# Altium project MABSS_voltageSensor.PrjPcb
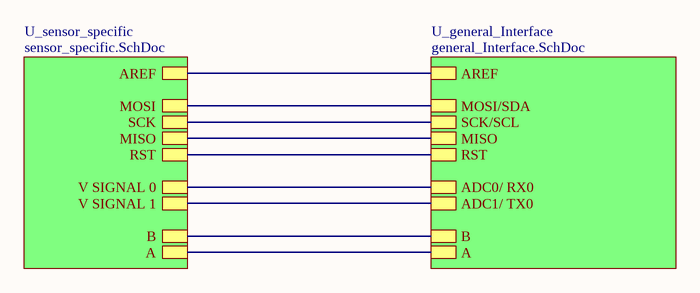
[diagram p0: master_sheet.SchDoc]
3 sheets, 22 parts. Net scope: hierarchical (ports join the sheet entries above them; power ports are global).
Board file: MABSS_voltageSensor.PcbDoc
Sheets:
  master_sheet.SchDoc
    U_sensor_specific = sensor_specific.SchDoc
    U_general_Interface = general_Interface.SchDoc

## Sheet master_sheet.SchDoc
size A4

### Sub-sheets
U_general_Interface = general_Interface.SchDoc: AREF, MOSI/SDA, SCK/SCL, MISO, RST, ADC0/ RX0, ADC1/ TX0, B, A
U_sensor_specific = sensor_specific.SchDoc: MOSI, SCK, MISO, RST, B, A, AREF, V SIGNAL 0, V SIGNAL 1

### Nets
NetHDR1_1: sheet U_sensor_specific/MISO, sheet U_general_Interface/MISO
NetHDR1_3: sheet U_sensor_specific/SCK, sheet U_general_Interface/SCK/SCL
NetHDR1_4: sheet U_sensor_specific/MOSI, sheet U_general_Interface/MOSI/SDA
NetHDR1_5: sheet U_sensor_specific/RST, sheet U_general_Interface/RST
NetHDR2_2: sheet U_sensor_specific/A, sheet U_general_Interface/A
NetHDR2_3: sheet U_sensor_specific/B, sheet U_general_Interface/B
NetR1_1: sheet U_sensor_specific/AREF, sheet U_general_Interface/AREF
NetR2_2: sheet U_sensor_specific/V SIGNAL 1, sheet U_general_Interface/ADC1/ TX0
NetR4_2: sheet U_sensor_specific/V SIGNAL 0, sheet U_general_Interface/ADC0/ RX0

## Sheet sensor_specific.SchDoc
size A4
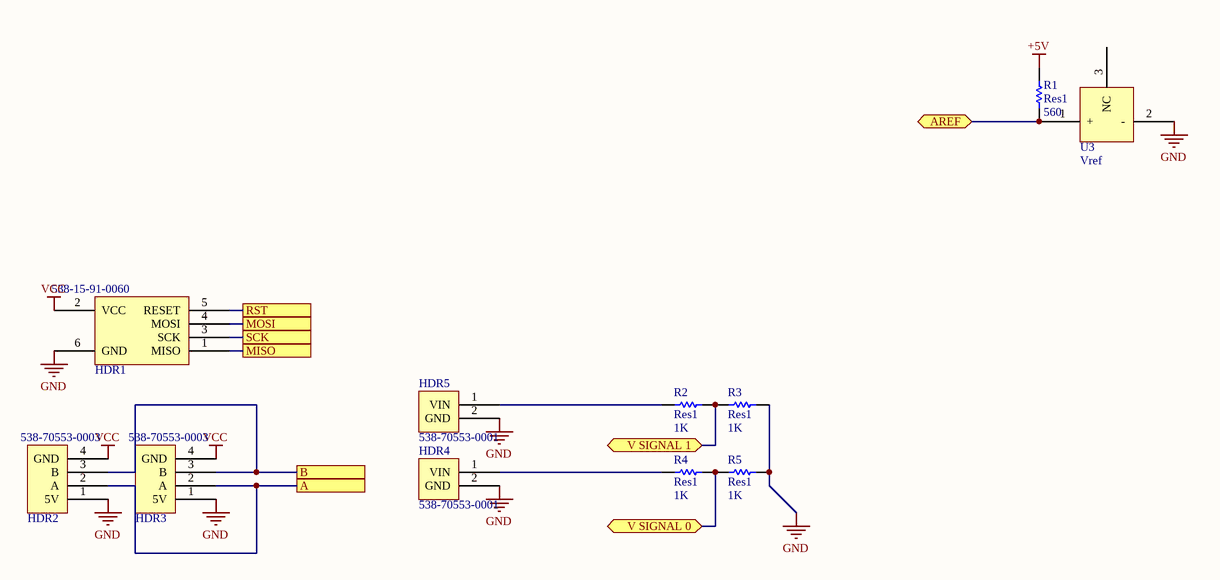
[diagram p1: sensor_specific.SchDoc]

### Parts
HDR1  Supplier Part Number 1: 538-15-91-0060  [MOLEX_HEADER_6_SMD]  (hidden comment: Programming header)
HDR2  Supplier Part Number 1: 538-70553-0003  [MOLEX_HEADER_4H_SHRD]  (hidden comment: RS-485 interface)
HDR3  Supplier Part Number 1: 538-70553-0003  [MOLEX_HEADER_4H_SHRD]  (hidden comment: RS-485 interface)
HDR4  Supplier Part Number 1: 538-70553-0001  [MOLEX_HEADER_2H_SHRD]  (hidden comment: MOLEX_HEADER_2H_SHRD)
HDR5  Supplier Part Number 1: 538-70553-0001  [MOLEX_HEADER_2H_SHRD]  (hidden comment: MOLEX_HEADER_2H_SHRD)
R1  Res1  value 560  [6-0805_N]
R2  Res1  value 1K  [J1-0603]
R3  Res1  value 1K  [J1-0603]
R4  Res1  value 1K  [J1-0603]
R5  Res1  value 1K  [J1-0603]
U3  Vref  [SOT23_N]

### Ports
A, AREF, B, MISO, MOSI, RST, SCK, V SIGNAL 0, V SIGNAL 1

### Nets
+5V: R1.2
GND: HDR1.6(GND) HDR2.1(5V) HDR3.1(5V) HDR4.2(GND) HDR5.2(GND) R3.2 R5.2 U3.2(-)
VCC: HDR1.2(VCC) HDR2.4(GND) HDR3.4(GND)
NetHDR1_1: HDR1.1(MISO) ; port MISO
NetHDR1_3: HDR1.3(SCK) ; port SCK
NetHDR1_4: HDR1.4(MOSI) ; port MOSI
NetHDR1_5: HDR1.5(RESET) ; port RST
NetHDR2_2: HDR2.2(A) HDR3.2(A) ; port A
NetHDR2_3: HDR2.3(B) HDR3.3(B) ; port B
NetHDR4_1: HDR4.1(VIN) R4.1
NetHDR5_1: HDR5.1(VIN) R2.1
NetR1_1: R1.1 U3.1(+) ; port AREF
NetR2_2: R2.2 R3.1 ; port V SIGNAL 1
NetR4_2: R4.2 R5.1 ; port V SIGNAL 0

Not connected (* = marked no-connect by the designer): U3 3(NC)

### Library data of the parts
HDR1 = PRGM_HDR: Supplier 1: Mouser
HDR2 HDR3 = MABSS_RS485: Part Number: 70553-0003. MABSS connector; Supplier 1: Mouser
HDR4 HDR5 = MOLEX_HEADER_2H_SHRD: Part Number: 70553-0001. 2-wire signal inputs; Supplier 1: Mouser
R1-R5 = Res1: Resistor; Published: 8-Jun-2000; LatestRevisionDate: 17-Jul-2002; LatestRevisionNote: Re-released for DXP Platform.; PackageReference: AXIAL-0.3; Publisher: Altium Limited; PackageDescription: Axial Device, Thru-Hole; 2 Leads; 0.3 in Pin Spacing

## Sheet general_Interface.SchDoc
size A4
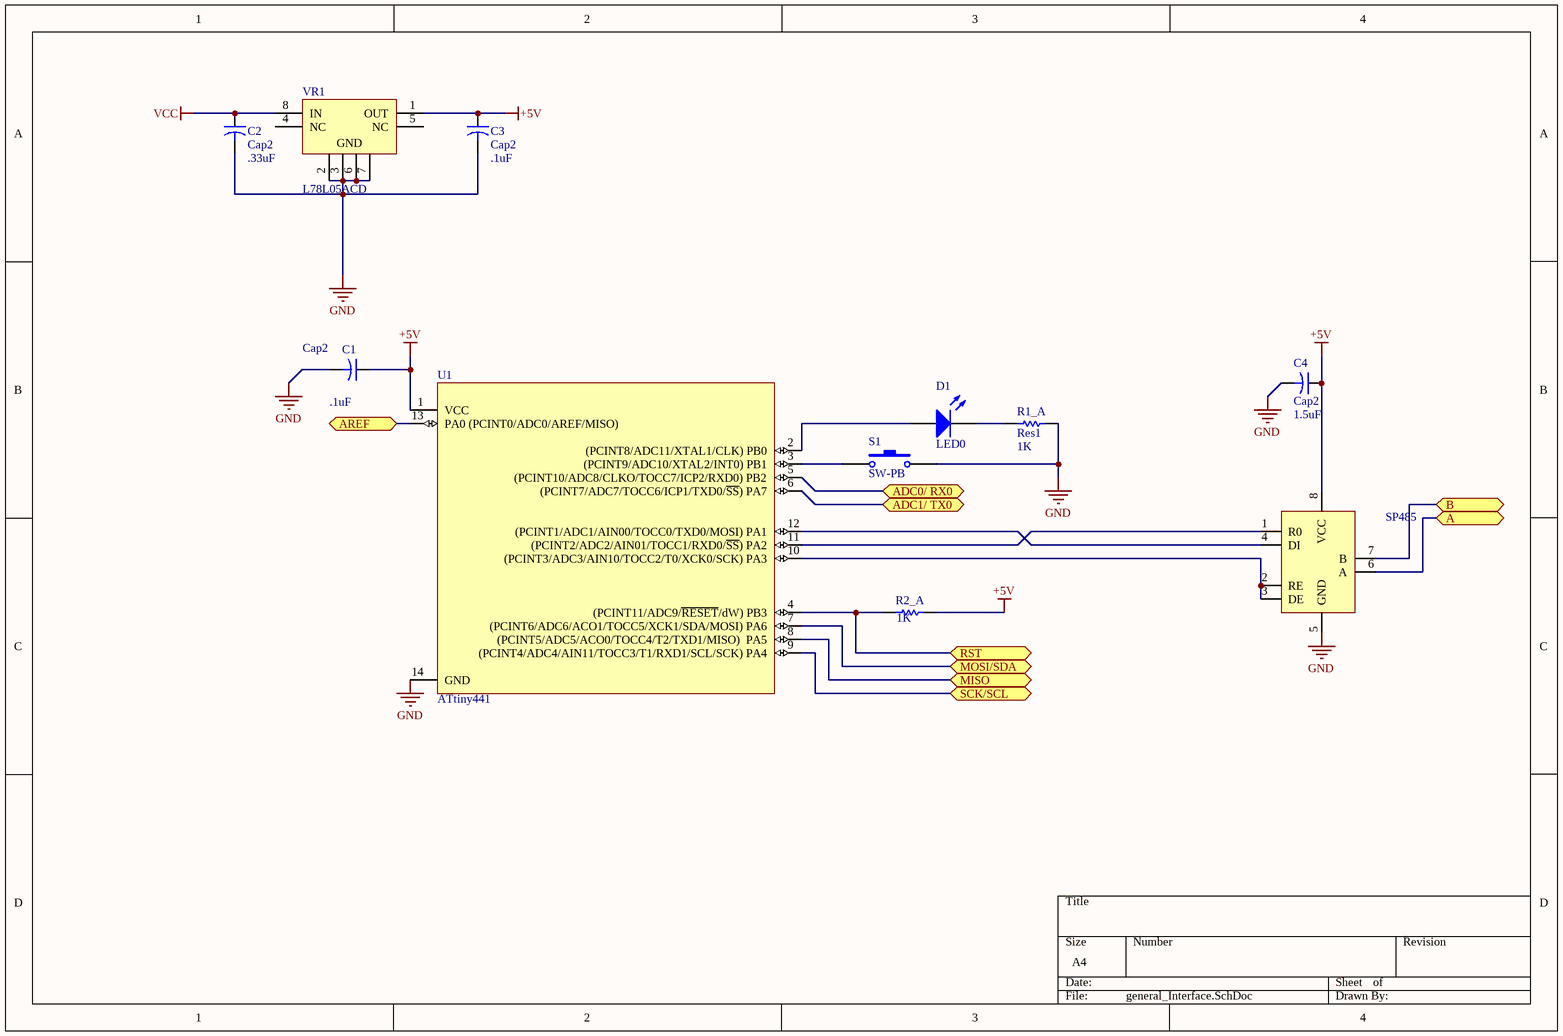
[diagram p2: general_Interface.SchDoc]

### Parts
C1  Cap2  value .1uF  [6-0805_N]
C2  Cap2  value .33uF  [6-0805_N]
C3  Cap2  value .1uF  [6-0805_N]
C4  Cap2  value 1.5uF  [6-0805_N]
D1  LED0  [1608[0603]]
R1_A  Res1  value 1K  [6-0805_N]
R2_A  value 1K  [J1-0603]  (hidden comment: Res1)
S1  SW-PB  [ADTSM3]
SP485  SP485  [8S1_M]  (value not drawn)
U1  ATtiny441  [6ST1_L]
VR1  L78L05ACD  [8S1_N]

### Ports
A, ADC0/ RX0, ADC1/ TX0, AREF, B, MISO, MOSI/SDA, RST, SCK/SCL

### Nets
+5V: C1.1 C3.1 C4.1 R2_A.2 SP485.8(VCC) U1.1(VCC) VR1.1(OUT)
GND: C1.2 C2.2 C3.2 C4.2 R1_A.2 S1.2 SP485.5(GND) U1.14(GND) VR1.2(GND) VR1.3(GND) VR1.6(GND) VR1.7(GND)
VCC: C2.1 VR1.8(IN)
NetD1_1: D1.1(A) U1.2((PCINT8/ADC11/XTAL1/CLK)_PB0)
NetD1_2: D1.2(K) R1_A.1
NetHDR1_1: U1.8((PCINT5/ADC5/ACO0/TOCC4/T2/TXD1/MISO)__PA5) ; port MISO
NetHDR1_3: U1.9((PCINT4/ADC4/AIN11/TOCC3/T1/RXD1/SCL/SCK)_PA4) ; port SCK/SCL
NetHDR1_4: U1.7((PCINT6/ADC6/ACO1/TOCC5/XCK1/SDA/MOSI)_PA6) ; port MOSI/SDA
NetHDR1_5: R2_A.1 U1.4((PCINT11/ADC9/~{RESET}/dW)_PB3) ; port RST
NetHDR2_2: SP485.6(A) ; port A
NetHDR2_3: SP485.7(B) ; port B
NetR1_1: U1.13(PA0_(PCINT0/ADC0/AREF/MISO)) ; port AREF
NetR2_2: U1.6((PCINT7/ADC7/TOCC6/ICP1/TXD0/~{SS})_PA7) ; port ADC1/ TX0
NetR4_2: U1.5((PCINT10/ADC8/CLKO/TOCC7/ICP2/RXD0)_PB2) ; port ADC0/ RX0
NetS1_1: S1.1 U1.3((PCINT9/ADC10/XTAL2/INT0)_PB1)
NetSP485_1: SP485.1(R0) U1.11((PCINT2/ADC2/AIN01/TOCC1/RXD0/~{SS})_PA2)
NetSP485_2: SP485.2(RE) SP485.3(DE) U1.10((PCINT3/ADC3/AIN10/TOCC2/T0/XCK0/SCK)_PA3)
NetSP485_4: SP485.4(DI) U1.12((PCINT1/ADC1/AIN00/TOCC0/TXD0/MOSI)_PA1)

Not connected (* = marked no-connect by the designer): VR1 4(NC) 5(NC)

### Library data of the parts
C1-C4 = Cap2: Capacitor; Published: 23-Sep-2002; PackageReference: CAPR5-4X5; Publisher: Altium Limited; PackageDescription: Capacitor; 2 Leads
D1 = LED0: Typical INFRARED GaAs LED; Published: 8-Jun-2000; LatestRevisionDate: 08-Jul-2005; LatestRevisionNote: Mech Layer 1 removed.; PackageReference: LED-0; Publisher: Altium Limited; PackageDescription: LED; 2 Leads
R1_A R2_A = Res1: Resistor; Published: 8-Jun-2000; LatestRevisionDate: 17-Jul-2002; LatestRevisionNote: Re-released for DXP Platform.; PackageReference: AXIAL-0.3; Publisher: Altium Limited; PackageDescription: Axial Device, Thru-Hole; 2 Leads; 0.3 in Pin Spacing
S1 = SW-PB: Switch; Published: 24-Mar-1999; LatestRevisionDate: 17-Jul-2002; LatestRevisionNote: Re-released for DXP Platform.; PackageReference: SPST-2; Publisher: Altium Limited; PackageDescription: Switch; 2 Leads
VR1 = L78L05ACD: Positive Voltage Regulator; Published: 24-Aug-2001; LatestRevisionDate: 13-Apr-2006; LatestRevisionNote: IPC-7351 Footprint Added.; DatasheetVersion: Feb-1999; PackageVersion: Dec-2002; PackageReference: SO8; Publisher: Altium Limited; PackageDescription: 8-Pin Small Outline Integrated Circuit 1.27 mm Pitch; Code_JEDEC: MS-012-AA; Code_IPC: SOIC127P600-8; ComponentLink1Description: Manufacturer Link; ComponentLink1URL: http://www.st.com/

## Nets that join several sheets
+5V: sensor_specific (R1.2), general_Interface (7 pins)
GND: sensor_specific (8 pins), general_Interface (12 pins)
VCC: sensor_specific (HDR1.2 HDR2.4 HDR3.4), general_Interface (C2.1 VR1.8)
NetHDR1_1: sensor_specific (HDR1.1), general_Interface (U1.8)
NetHDR1_3: sensor_specific (HDR1.3), general_Interface (U1.9)
NetHDR1_4: sensor_specific (HDR1.4), general_Interface (U1.7)
NetHDR1_5: sensor_specific (HDR1.5), general_Interface (R2_A.1 U1.4)
NetHDR2_2: sensor_specific (HDR2.2 HDR3.2), general_Interface (SP485.6)
NetHDR2_3: sensor_specific (HDR2.3 HDR3.3), general_Interface (SP485.7)
NetR1_1: sensor_specific (R1.1 U3.1), general_Interface (U1.13)
NetR2_2: sensor_specific (R2.2 R3.1), general_Interface (U1.6)
NetR4_2: sensor_specific (R4.2 R5.1), general_Interface (U1.5)